# EAGLE schematic ws2811 (EAGLE 9.1.0)
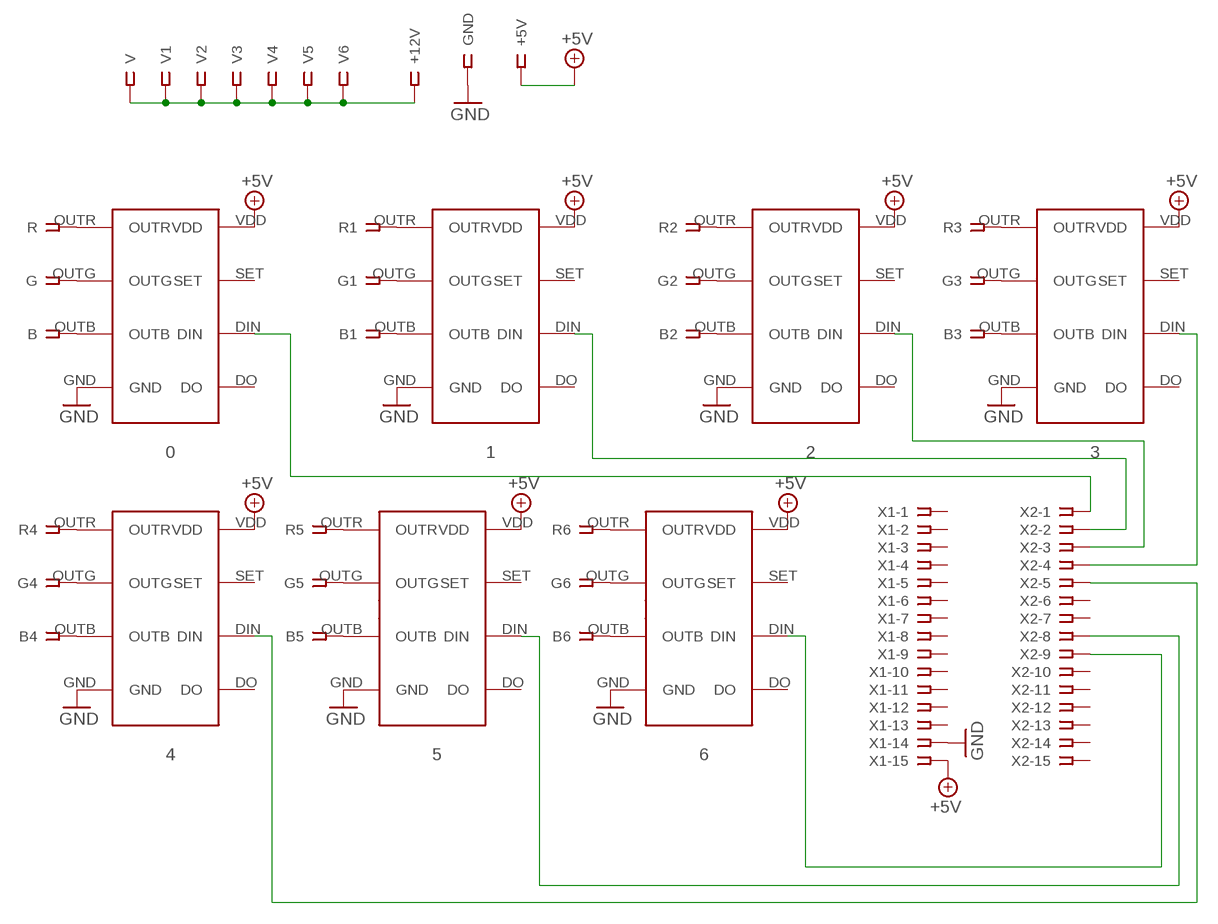
[diagram p0: schematic, sheet 1]

## Parts
0  WS2811  [SOP8]
1  WS2811  [SOP8]
2  WS2811  [SOP8]
3  WS2811  [SOP8]
4  WS2811  [SOP8]
5  WS2811  [SOP8]
6  WS2811  [SOP8]
+5V  SSW-101-02-G-S  [SSW-101-02-G-S]
+12V  SSW-101-02-G-S  [SSW-101-02-G-S]
B  SSW-101-02-G-S  [SSW-101-02-G-S]
B1  SSW-101-02-G-S  [SSW-101-02-G-S]
B2  SSW-101-02-G-S  [SSW-101-02-G-S]
B3  SSW-101-02-G-S  [SSW-101-02-G-S]
B4  SSW-101-02-G-S  [SSW-101-02-G-S]
B5  SSW-101-02-G-S  [SSW-101-02-G-S]
B6  SSW-101-02-G-S  [SSW-101-02-G-S]
G  SSW-101-02-G-S  [SSW-101-02-G-S]
G1  SSW-101-02-G-S  [SSW-101-02-G-S]
G2  SSW-101-02-G-S  [SSW-101-02-G-S]
G3  SSW-101-02-G-S  [SSW-101-02-G-S]
G4  SSW-101-02-G-S  [SSW-101-02-G-S]
G5  SSW-101-02-G-S  [SSW-101-02-G-S]
G6  SSW-101-02-G-S  [SSW-101-02-G-S]
GND  SSW-101-02-G-S  [SSW-101-02-G-S]
R  SSW-101-02-G-S  [SSW-101-02-G-S]
R1  SSW-101-02-G-S  [SSW-101-02-G-S]
R2  SSW-101-02-G-S  [SSW-101-02-G-S]
R3  SSW-101-02-G-S  [SSW-101-02-G-S]
R4  SSW-101-02-G-S  [SSW-101-02-G-S]
R5  SSW-101-02-G-S  [SSW-101-02-G-S]
R6  SSW-101-02-G-S  [SSW-101-02-G-S]
V  SSW-101-02-G-S  [SSW-101-02-G-S]
V1  SSW-101-02-G-S  [SSW-101-02-G-S]
V2  SSW-101-02-G-S  [SSW-101-02-G-S]
V3  SSW-101-02-G-S  [SSW-101-02-G-S]
V4  SSW-101-02-G-S  [SSW-101-02-G-S]
V5  SSW-101-02-G-S  [SSW-101-02-G-S]
V6  SSW-101-02-G-S  [SSW-101-02-G-S]
X1  SSW-115-02-G-S  [SSW-115-02-G-S]
X2  SSW-115-02-G-S  [SSW-115-02-G-S]

## Nets
+5V: 0.VDD 1.VDD 2.VDD 3.VDD 4.VDD 5.VDD 6.VDD +5V.1 X1.15
GND: 0.GND 1.GND 2.GND 3.GND 4.GND 5.GND 6.GND GND.1 X1.14
N$1: 1.OUTR R1.1
N$2: 2.OUTR R2.1
N$3: 3.OUTR R3.1
N$4: 0.OUTB B.1
N$5: 0.OUTG G.1
N$6: 0.OUTR R.1
N$7: 4.OUTR R4.1
N$8: 5.OUTR R5.1
N$9: 6.OUTR R6.1
N$10: 1.OUTG G1.1
N$11: 3.OUTG G3.1
N$12: 4.OUTG G4.1
N$13: 5.OUTG G5.1
N$14: 6.OUTG G6.1
N$15: 1.OUTB B1.1
N$16: 2.OUTB B2.1
N$17: 3.OUTB B3.1
N$18: 4.OUTB B4.1
N$19: 5.OUTB B5.1
N$20: 6.OUTB B6.1
N$21: 2.OUTG G2.1
N$22: 0.DIN X2.1
N$23: 1.DIN X2.2
N$24: 2.DIN X2.3
N$25: 3.DIN X2.4
N$26: 4.DIN X2.5
N$27: 5.DIN X2.8
N$28: 6.DIN X2.9
N$29: +12V.1 V1.1 V2.1 V3.1 V4.1 V5.1 V6.1 V.1
Unconnected: 0.DO 0.SET 1.DO 1.SET 2.DO 2.SET 3.DO 3.SET 4.DO 4.SET 5.DO 5.SET 6.DO 6.SET X1.1 X1.2 X1.3 X1.4 X1.5 X1.6 X1.7 X1.8 X1.9 X1.10 X1.11 X1.12 X1.13 X2.6 X2.7 X2.10 X2.11 X2.12 X2.13 X2.14 X2.15

## Library data of the parts
0 1-6 = ws2811:WS2811
+5V +12V B B1-B6 G G1-G6 GND R R1-R6 V V1-V6 = con-samtec:SSW-101-02-G-S: THROUGH-HOLE .025" SQ POST SOCKET Source: Samtec SSW.pdf; MF: Samtec Inc.; MPN: SSW-101-02-G-S; OC_FARNELL: unknown; OC_NEWARK: 11P9336
X1 X2 = con-samtec:SSW-115-02-G-S: THROUGH-HOLE .025" SQ POST SOCKET Source: Samtec SSW.pdf; MF: Samtec Inc.; MPN: SSW-115-02-G-S; OC_FARNELL: unknown; OC_NEWARK: 11P9564